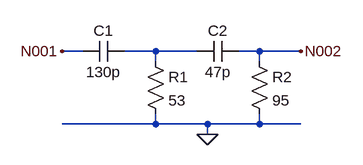
[diagram p0: schematic pasa_altas.asc]
pasa_altas.asc, the LTspice schematic file:
Version 4
SHEET 1 880 680
WIRE 112 128 80 128
WIRE 224 128 176 128
WIRE 288 128 224 128
WIRE 384 128 352 128
WIRE 448 128 384 128
WIRE 224 144 224 128
WIRE 384 144 384 128
WIRE 224 240 224 224
WIRE 224 240 80 240
WIRE 304 240 224 240
WIRE 384 240 384 224
WIRE 384 240 304 240
WIRE 448 240 384 240
WIRE 304 256 304 240
FLAG 304 256 0
FLAG 80 128 N001
FLAG 448 128 N002
SYMBOL cap 176 112 R90
WINDOW 0 0 32 VBottom 2
WINDOW 3 32 32 VTop 2
SYMATTR InstName C1
SYMATTR Value 130p
SYMBOL cap 352 112 R90
WINDOW 0 0 32 VBottom 2
WINDOW 3 32 32 VTop 2
SYMATTR InstName C2
SYMATTR Value 47p
SYMBOL res 208 128 R0
SYMATTR InstName R1
SYMATTR Value 53
SYMBOL res 368 128 R0
SYMATTR InstName R2
SYMATTR Value 95

The netlist it stands for:
* pasa_altas.asc
C1 N003 N001 130p
C2 N002 N003 47p
R1 N003 0 53
R2 N002 0 95
.backanno
.end